# Altium schematic sheet POWER.SchDoc
size A4; DocumentNumber: 3; SheetNumber: 3; SheetTotal: 6
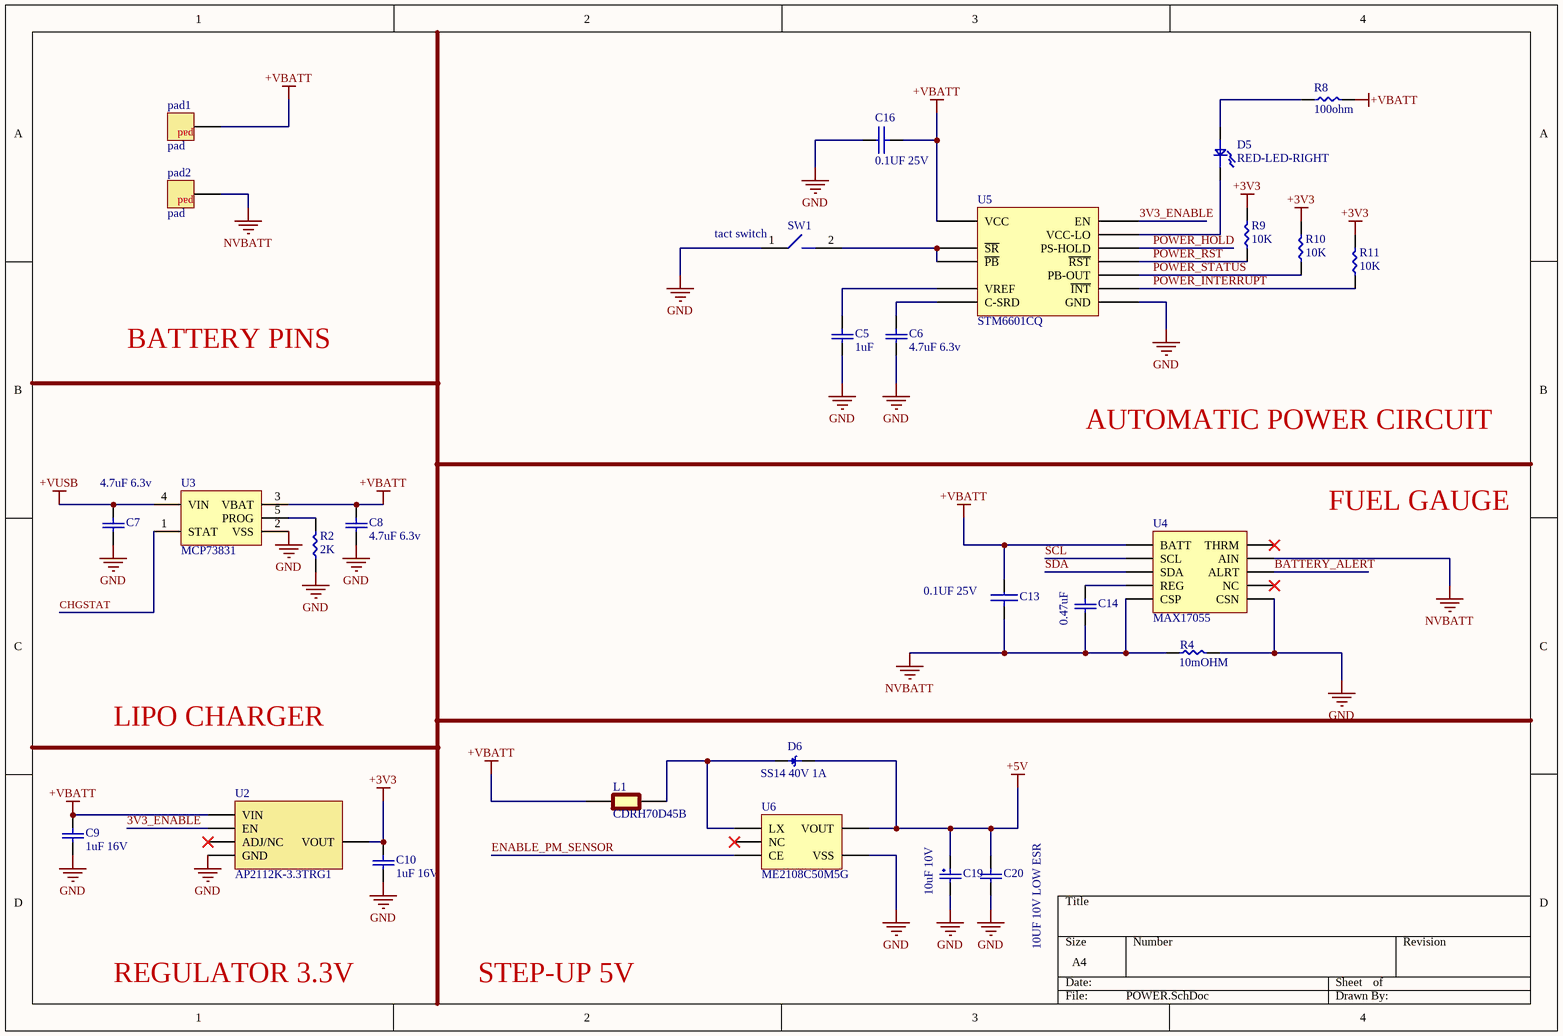
[diagram p0: POWER.SchDoc]

## Parts
C5  1uF  [C0603]
C6  4.7uF 6.3v  [C0603]
C7  4.7uF 6.3v  [C0603]
C8  4.7uF 6.3v  [C0603]
C9  1uF 16V  [C0805]
C10  1uF 16V  [C0805]
C13  0.1UF 25V  [C0603]
C14  0.47uF  [C0603]
C16  0.1UF 25V  [C0603]
C19  10uF 10V  [C3216]
C20  10UF 10V LOW ESR  [C1206]
D5  RED-LED-RIGHT  [LED0805RIGHT]
D6  SS14 40V 1A  [SMA]
L1  CDRH70D45B  [CDRH70D45B]
pad1  pad  [Pad 5x4mm]  (no BOM)
pad2  pad  [Pad 5x4mm]  (no BOM)
R2  2K  [R0603]
R4  10mOHM  [R2512]
R8  100ohm  [R0603]
R9  10K  [R0603]
R10  10K  [R0603]
R11  10K  [R0603]
SW1  tact switch  [Tacticle smd]
U2  AP2112K-3.3TRG1  [SOT-23-5]
U3  MCP73831  [SOT-23-5]
U4  MAX17055  [TDFN-EP]
U5  STM6601CQ  [SON50P300X200X80-12N]
U6  ME2108C50M5G  [SOT-23-5]

## Nets
+3V3: C10.2 R9.2 R10.2 R11.2 U2.5(VOUT)
+5V: C19.2 C20.2 D6.2 U6.2(VOUT)
+VBATT: C8.2 C9.2 C13.1 C16.2 L1.1 pad1.1 R8.2 U2.1(VIN) U3.3(VBAT) U4.10(BATT) U5.1(VCC)
+VUSB: C7.2 U3.4(VIN)
GND: C5.1 C6.1 C7.1 C8.1 C9.1 C10.1 C16.1 C19.1 C20.1 R2.1 R4.2 SW1.1 U2.2(GND) U3.2(VSS) U4.5(CSN) U5.12(GND) U6.4(VSS)
NVBATT: C13.2 C14.1 pad2.1 R4.1 U4.2(AIN) U4.6(CSP)
3V3_ENABLE: U2.3(EN) U5.9(EN)
BATTERY_ALERT: U4.8(ALRT)
CHGSTAT: U3.1(STAT)
ENABLE_PM_SENSOR: U6.1(CE)
POWER_HOLD: U5.4(PS-HOLD)
POWER_INTERRUPT: R11.1 U5.11(~{INT})
POWER_RST: R9.1 U5.10(~{RST})
POWER_STATUS: R10.1 U5.8(PB-OUT)
SCL: U4.3(SCL)
SDA: U4.4(SDA)
NetC5_2: C5.2 U5.3(VREF)
NetC6_2: C6.2 U5.5(C-SRD)
NetC14_2: C14.2 U4.7(REG)
NetD5_1: D5.1 R8.1
NetD5_2: D5.2 U5.7(VCC-LO)
NetD6_1: D6.1 L1.2 U6.5(LX)
NetR2_2: R2.2 U3.5(PROG)
NetSW1_2: SW1.2 U5.2(~{SR}) U5.6(~{PB})

Not connected (* = marked no-connect by the designer): U2 4(ADJ/NC)*; U4 1(NC)* 9(THRM)*; U6 3(NC)*

## Notes on the sheet
- BATTERY PINS
- AUTOMATIC POWER CIRCUIT
- FUEL GAUGE
- LIPO CHARGER
- REGULATOR 3.3V
- STEP-UP 5V

## Library data of the parts
C5 = UMK107BJ105KA-T: CAP CER 1UF 50V X5R 0603; Manufacturer: Taiyo Yuden; Catalog Drawings: xMK Series_0603_0.8; Capacitance: 1µF; Tolerance: ±10%; Online Catalog: M Series; Other Names: 587-2400-6; Supplier 1: Digi-Key; Manufacturer Part Number: UMK107BJ105KA-T; Stock 1: 2604996; Pricing 1: 1=0.18, 10=0.129, 100=0.0605, 500=0.0424, 1000=0.0351 (USD); Standard Package: 1; Category: Capacitors; Family: Ceramic Capacitors; Series: M; Packaging: Digi-Reel®; Voltage - Rated: 50V; Temperature Coefficient: X5R; Mounting Type: Surface Mount, MLCC; Operating Temperature: -55°C ~ 85°C; Applications: General Purpose; Ratings: -; Package / Case: 0603 (1608 Metric); Size / Dimension: 0.063" L x 0.031" W (1.60mm x 0.80mm); Height - Seated (Max): -; Thickness (Max): 0.035" (0.90mm); Lead Spacing: -; Features: -; Lead Style: -; ComponentLink1URL: http://www.farnell.com/datasheets/2091858.pdf?src-supplier=Farnell; ComponentLink1Description: http://www.farnell.com/datasheets/2091858.pdf?src-supplier=Farnell; ComponentLink2URL: https://www.yuden.co.jp/productdata/catalog/mlcc_all_e.pdf?src-supplier=Avnet; ComponentLink2Description: https://www.yuden.co.jp/productdata/catalog/mlcc_all_e.pdf?src-supplier=Avnet; ComponentLink3URL: https://www.yuden.co.jp/productdata/catalog/mlcc_all_e.pdf?src-supplier=Onlinecomponents.com; ComponentLink3Description: https://www.yuden.co.jp/productdata/catalog/mlcc_all_e.pdf?src-supplier=Onlinecomponents.com; ComponentLink4URL: http://ds.yuden.co.jp/TYCOMPAS/ut/detail.do?productNo=UMK107BJ105KA-T&amp;fileName=UMK107BJ105KA-T_SS&amp;mode=specSheetDownload&src-supplier=Digi-Key; ComponentLink4Description: http://ds.yuden.co.jp/TYCOMPAS/ut/detail.do?productNo=UMK107BJ105KA-T&amp;fileName=UMK107BJ105KA-T_SS&amp;mode=specSheetDownload&src-supplier=Digi-Key; ComponentLink5URL: http://www.farnell.com/datasheets/2091858.pdf?src-supplier=Element14; ComponentLink5Description: http://www.farnell.com/datasheets/2091858.pdf?src-supplier=Element14; ComponentLink6URL: http://www.yuden.co.jp/ut/product/pdf_html/pdf/mlcc_all_e.pdf?src-supplier=Element14; ComponentLink6Description: http://www.yuden.co.jp/ut/product/pdf_html/pdf/mlcc_all_e.pdf?src-supplier=Element14; ComponentLink7URL: https://www.yuden.co.jp/productdata/catalog/mlcc_all_e.pdf?src-supplier=Mouser; ComponentLink7Description: https://www.yuden.co.jp/productdata/catalog/mlcc_all_e.pdf?src-supplier=Mouser; Supplier Part Number 1: 587-2400-1-ND
C6-C8 = C0603C475K9PACTU: KEMET - C0603C475K9PACTU - KONDENSATOR, 4.7µF, 6.3V, 10%, X5R, 0603; Capacitor Terminals: SMD; SVHC: –; Capacitor Case Style: 0603; Supplier 1: Digi-Key; Manufacturer: KEMET; Manufacturer Part Number: C0603C475K9PACTU; Stock 1: 2903916; Pricing 1: 1=0.17, 10=0.12, 100=0.0565, 500=0.0396, 1000=0.0328 (USD); Lead Spacing: –; MSL: –; Capacitance: 4.7µF; Capacitance Tolerance: ± 10%; Dielectric Characteristic: X5R; Voltage Rating: 6.3V; Operating Temperature Range: -55°C to +85°C; ComponentLink1URL: https://api.kemet.com/component-edge/download/datasheet/C0603C475K9PACTU.pdf?src-supplier=Digi-Key; ComponentLink1Description: https://api.kemet.com/component-edge/download/datasheet/C0603C475K9PACTU.pdf?src-supplier=Digi-Key; ComponentLink2URL: http://www.farnell.com/datasheets/2739654.pdf?src-supplier=Element14; ComponentLink2Description: http://www.farnell.com/datasheets/2739654.pdf?src-supplier=Element14; ComponentLink3URL: http://www.farnell.com/datasheets/40889.pdf?src-supplier=Element14; ComponentLink3Description: http://www.farnell.com/datasheets/40889.pdf?src-supplier=Element14; Supplier Part Number 1: 399-3482-1-ND
C9 C10 = GRM21BR71C105KA01L: CAP CER 1UF 16V X7R 0805; Manufacturer: Murata Electronics North America; Tolerance: ±10%; Supplier 1: Digi-Key; Manufacturer Part Number: GRM21BR71C105KA01L; RoHS: RoHS Compliant; Category: Capacitors; Stock 1: 397728; Pricing 1: 1=0.11, 10=0.083, 100=0.0372, 500=0.02656, 1000=0.02087 (USD); Packaging: Cut Tape (CT); Part Status: Active; Voltage - Rated: 16V; Temperature Coefficient: X7R; Operating Temperature: -55°C ~ 125°C; Features: -; Ratings: -; Applications: General Purpose; Mounting Type: Surface Mount, MLCC; Package / Case: 0805 (2012 Metric); Size / Dimension: 0.079" L x 0.049" W (2.00mm x 1.25mm); Height - Seated (Max): -; Thickness (Max): 0.053" (1.35mm); Lead Spacing: -; Lead Style: -; ComponentLink1URL: http://search.murata.co.jp/Ceramy/image/img/A01X/G101/ENG/GRM21BR71C105KA01-01.pdf; ComponentLink1Description: http://search.murata.co.jp/Ceramy/image/img/A01X/G101/ENG/GRM21BR71C105KA01-01.pdf; Supplier Part Number 1: 490-1691-1-ND
C13 C16 = 06033D104KAT2A: CAP CER 0.1UF 25V X5R 0603; Manufacturer: Kyocera AVX; Capacitance: 100 nF; Tolerance (%): ±10 %; Supplier 1: Digi-Key; Manufacturer Part Number: 06033D104KAT2A; Stock 1: 0; Pricing 1: 1=0.32, 10=0.221, 100=0.1328, 500=0.0996, 1000=0.0841 (USD); Case Size/Dimension: 0603; Dielectric: X5R; Rated Voltage: 25 V; ComponentLink1URL: https://datasheet.ciiva.com/19475/1031061-19475906.pdf; ComponentLink1Description: https://datasheet.ciiva.com/19475/1031061-19475906.pdf; ComponentLink2URL: https://datasheet.ciiva.com/28613/759405-28613274.pdf; ComponentLink2Description: https://datasheet.ciiva.com/28613/759405-28613274.pdf; ComponentLink3URL: https://datasheet.ciiva.com/16397/cx5r-16397162.pdf; ComponentLink3Description: https://datasheet.ciiva.com/16397/cx5r-16397162.pdf; ComponentLink4URL: https://datasheet.ciiva.com/28613/1666675-28613037.pdf; ComponentLink4Description: https://datasheet.ciiva.com/28613/1666675-28613037.pdf; ComponentLink5URL: https://datasheet.ciiva.com/28613/1666675-28613275.pdf; ComponentLink5Description: https://datasheet.ciiva.com/28613/1666675-28613275.pdf; ComponentLink6URL: https://datasheet.ciiva.com/152/cx5r-152227.pdf; ComponentLink6Description: https://datasheet.ciiva.com/152/cx5r-152227.pdf; ComponentLink7URL: https://datasheet.ciiva.com/152/cx5r-152226.pdf; ComponentLink7Description: https://datasheet.ciiva.com/152/cx5r-152226.pdf; ComponentLink8URL: https://datasheet.ciiva.com/2987/cx5r-2987761.pdf; ComponentLink8Description: https://datasheet.ciiva.com/2987/cx5r-2987761.pdf; ComponentLink9URL: https://datasheet.ciiva.com/152/cx5r-152225.pdf; ComponentLink9Description: https://datasheet.ciiva.com/152/cx5r-152225.pdf; ComponentLink10URL: https://datasheet.ciiva.com/2987/cx5r-2987762.pdf; ComponentLink10Description: https://datasheet.ciiva.com/2987/cx5r-2987762.pdf; Supplier Part Number 1: 478-1244-6-ND
C14 = C0603C474K4PACTU: CAP CER 0.47UF 16V 10% X5R 0603; Manufacturer: KEMET; Part # Aliases: C0603C474K4PAC7867; Capacitance - nF: 470 nF; Capacitance - pF: 470000 pF; Case Height: 0.8 mm; Dissipation Factor DF: 5; Case Length: 1.6 mm; Class: Class 2; Temperature Coefficient / Code: +/- 15 %; Type: SMD MLCC X5R 4 - 50 VDC Commerical Grade; Supplier 1: Digi-Key; Manufacturer Part Number: C0603C474K4PACTU; Stock 1: 22191; Pricing 1: 1=0.17, 10=0.118, 100=0.0556, 500=0.039, 1000=0.0323 (USD); Brand: Kemet; Capacitance: 0.47 uF; Case Code - in: 0603; Case Code - mm: 1608; Dimensions: 0.8 mm W x 1.6 mm L x 0.8 mm H; Dielectric: X5R; Case Width: 0.8 mm; Factory Pack Quantity: 4000; Product Category: Multilayer Ceramic Capacitors MLCC - SMD/SMT; RoHS: Details; Tolerance: 10 %; Minimum Operating Temperature: - 55 C; Maximum Operating Temperature: + 85 C; Product: General Type MLCCs; Lead Spacing: 0.7 mm; Operating Temperature Range: - 55 C to + 85 C; Package / Case: 0603 (1608 metric); Packaging: Reel; Series: C0603C; Termination Style: SMD/SMT; Voltage Rating: 16 V; Voltage Rating DC: 16 V; Supplier Part Number 1: 399-7934-1-ND
C19 = T491A106K010AT: CAP TANT 10UF 10V 10% 1206; Manufacturer: KEMET; Manufacturer Size Code: A; Type: Molded; ESR (Equivalent Series Resistance): 3.8 Ohm; Lifetime @ Temp.: 2000 Hrs @ 85°C; Supplier 1: Digi-Key; Manufacturer Part Number: T491A106K010AT; RoHS: RoHS Compliant; Category: Capacitors; Stock 1: 741056; Pricing 1: 1=0.41, 10=0.287, 100=0.1721, 500=0.12912, 1000=0.10903 (USD); Packaging: Cut Tape (CT); Part Status: Active; Tolerance: ±10%; Operating Temperature: -55°C ~ 125°C; Mounting Type: Surface Mount; Package / Case: 1206 (3216 Metric); Size / Dimension: 0.126" L x 0.063" W (3.20mm x 1.60mm); Height - Seated (Max): 0.071" (1.80mm); Lead Spacing: -; Features: General Purpose; Failure Rate: -; ComponentLink1URL: http://www.kemet.com/Lists/ProductCatalog/Attachments/254/KEM_T2005_T491.pdf; ComponentLink1Description: http://www.kemet.com/Lists/ProductCatalog/Attachments/254/KEM_T2005_T491.pdf; Supplier Part Number 1: 399-3684-1-ND
C20 = LMK316BJ106MLHT: CAP CER 10UF 10V X5R 1206; Manufacturer: Taiyo Yuden; Tolerance: ±20%; Supplier 1: Digi-Key; Manufacturer Part Number: LMK316BJ106MLHT; RoHS: RoHS Compliant; Category: Capacitors; Stock 1: 0; Pricing 1: 2000=0.07458 (USD); Packaging: Tape & Reel (TR); Part Status: Active; Voltage - Rated: 10V; Temperature Coefficient: X5R; Operating Temperature: -55°C ~ 85°C; Features: Ultra Low ESR; Ratings: AEC-Q200; Applications: Automotive, SMPS Filtering; Failure Rate: -; Mounting Type: Surface Mount, MLCC; Package / Case: 1206 (3216 Metric); Size / Dimension: 0.126" L x 0.063" W (3.20mm x 1.60mm); Height - Seated (Max): -; Thickness (Max): 0.071" (1.80mm); Lead Spacing: -; Lead Style: -; ComponentLink1URL: http://www.yuden.co.jp/productdata/catalog/en/mlcc_all_hq_e.pdf; ComponentLink1Description: http://www.yuden.co.jp/productdata/catalog/en/mlcc_all_hq_e.pdf; Supplier Part Number 1: LMK316BJ106MLHT-ND
D5 = LTST-S270KRKT: LED RED CLEAR 0603 R/A SMD; Manufacturer: Lite-On Inc.; Lens Color: Colorless; Millicandela Rating: 54mcd; Lens Style/Size: Rectangle with Flat Top, 1.20mm x 0.60mm; Voltage - Forward (Vf) (Typ): 2V; Current - Test: 20mA; Viewing Angle: 130°; Wavelength - Dominant: 631nm; Wavelength - Peak: 639nm; Supplier 1: Digi-Key; Manufacturer Part Number: LTST-S270KRKT; RoHS: RoHS Compliant; Category: Optoelectronics; Stock 1: 443917; Pricing 1: 1=0.27, 10=0.196, 25=0.1448, 100=0.1034, 250=0.07032, 500=0.06204, 1000=0.0486 (USD); Packaging: Digi-Reel®; Part Status: Active; Color: Red; Lens Transparency: Clear; Mounting Type: Surface Mount, Right Angle; Features: -; Package / Case: 0603 (1608 Metric); Supplier Device Package: Chip LED; Size / Dimension: 1.60mm L x 1.15mm W; Height (Max): 0.60mm; ComponentLink1URL: http://optoelectronics.liteon.com/upload/download/DS22-2000-210/LTST-S270KRKT.pdf; ComponentLink1Description: http://optoelectronics.liteon.com/upload/download/DS22-2000-210/LTST-S270KRKT.pdf; Supplier Part Number 1: 160-1479-6-ND
D6 = SS14: DIODE SCHOTTKY 40V 1A SMA; Manufacturer: Microsemi; Rectifier Type: Schottky Diode; Configuration: Single; Rev Curr: 500uA; Peak Non-Repetitive Surge Current: 30A; Forward Voltage: 600mV; Supplier 1: Digi-Key; Manufacturer Part Number: SS14; Stock 1: 177418; Pricing 1: 1=0.38, 10=0.31, 25=0.2592, 100=0.1267, 250=0.1247, 500=0.1057, 1000=0.0734, 2500=0.0683 (USD); Peak Rep Rev Volt: 40V; Avg. Forward Curr (Max): 1A; Operating Temp Range: -55C to 125C; Package Type: DO-214AC; Operating Temperature Classification: Military; Mounting: Surface Mount; Pin Count: 2; Supplier Part Number 1: SS14DKR-ND
L1 = CDRH70D45BT150NP-470MC: Ind Power 47uF 20% Ferrite Drum Core; Manufacturer: Sumida; Supplier 1: Digi-Key; Manufacturer Part Number: CDRH70D45BT150NP-470MC; Stock 1: 0; Pricing 1: 1=2.73, 10=2.519, 100=1.763, 500=1.4272, 1000=1.3012 (USD); Supplier Part Number 1: 308-CDRH70D45BT150NP-470MCCT-ND
pad1 pad2 = Pad5x4mm
R2 = ERJ-3EKF2001V: RES SMD 2K OHM 1% 1/10W 0603; Manufacturer: Panasonic; Rated Power: 0.1 W; Resistance: 2 kO; Temp Coefficient: ±100 ppm/°C; Supplier 1: Digi-Key; Manufacturer Part Number: ERJ-3EKF2001V; Stock 1: 848013; Pricing 1: 1=0.1, 10=0.068, 100=0.0278, 1000=0.0125, 2500=0.0109 (USD); Size Code: 0603; Tolerance (%): ±1 %; ComponentLink1URL: http://industrial.panasonic.com/www-data/pdf/AOA0000/AOA0000CE2.pdf?src-supplier=Future+Electronics; ComponentLink1Description: http://industrial.panasonic.com/www-data/pdf/AOA0000/AOA0000CE2.pdf?src-supplier=Future+Electronics; ComponentLink2URL: http://industrial.panasonic.com/cdbs/www-data/pdf/RDA0000/AOA0000C304.pdf?src-supplier=Farnell; ComponentLink2Description: http://industrial.panasonic.com/cdbs/www-data/pdf/RDA0000/AOA0000C304.pdf?src-supplier=Farnell; ComponentLink3URL: http://www.farnell.com/datasheets/1678782.pdf?src-supplier=Element14; ComponentLink3Description: http://www.farnell.com/datasheets/1678782.pdf?src-supplier=Element14; ComponentLink4URL: http://www.farnell.com/datasheets/1911175.pdf?src-supplier=Element14; ComponentLink4Description: http://www.farnell.com/datasheets/1911175.pdf?src-supplier=Element14; ComponentLink5URL: https://industrial.panasonic.com/cdbs/www-data/pdf/RDA0000/DMA0000COL11.pdf?src-supplier=Allied+Electronics; ComponentLink5Description: https://industrial.panasonic.com/cdbs/www-data/pdf/RDA0000/DMA0000COL11.pdf?src-supplier=Allied+Electronics; ComponentLink6URL: http://industrial.panasonic.com/www-data/pdf/AOA0000/AOA0000CE2.pdf?src-supplier=Avnet+Europe; ComponentLink6Description: http://industrial.panasonic.com/www-data/pdf/AOA0000/AOA0000CE2.pdf?src-supplier=Avnet+Europe; ComponentLink7URL: http://www.farnell.com/datasheets/1911175.pdf?src-supplier=Farnell; ComponentLink7Description: http://www.farnell.com/datasheets/1911175.pdf?src-supplier=Farnell; ComponentLink8URL: https://industrial.panasonic.com/cdbs/www-data/pdf/RDA0000/DMA0000COL11.pdf?src-supplier=Mouser; ComponentLink8Description: https://industrial.panasonic.com/cdbs/www-data/pdf/RDA0000/DMA0000COL11.pdf?src-supplier=Mouser; Supplier Part Number 1: P2.00KHDKR-ND
R4 = CSR25120R01F: RES 0.01 OHM 1% 1W 2512; Manufacturer: Riedon; Resistance (Ohms): 0.01; Temperature Coefficient: ±75ppm/°C; Supplier 1: Digi-Key; Manufacturer Part Number: CSR25120R01F; Stock 1: 46648; Pricing 1: 1=0.64, 10=0.531, 25=0.4556, 50=0.4098, 100=0.3567, 250=0.3188, 500=0.2581, 1000=0.2087 (USD); Category: Resistors; Family: Chip Resistor - Surface Mount; Series: CSR; Packaging: Tape & Reel (TR); Tolerance: ±1%; Power (Watts): 1W; Composition: Metal Element; Features: Current Sense; Operating Temperature: -55°C ~ 170°C; Package / Case: 2512 (6432 Metric); Supplier Device Package: 2512; Size / Dimension: 0.250" L x 0.125" W (6.35mm x 3.18mm); Height: 0.033" (0.84mm); Number of Terminations: 2; ComponentLink1URL: https://riedon.com/media/pdf-tech/riedon_brochure_download.pdf?src-supplier=Digi-Key; ComponentLink1Description: https://riedon.com/media/pdf-tech/riedon_brochure_download.pdf?src-supplier=Digi-Key; ComponentLink2URL: http://riedon.com/media/pdf/CSR.pdf?src-supplier=Digi-Key; ComponentLink2Description: http://riedon.com/media/pdf/CSR.pdf?src-supplier=Digi-Key; Supplier Part Number 1: 696-1655-1-ND
R8 = CR0603-FX-1000ELF: Res Thick Film 0603 100 Ohm 1% 1/10W Â±100ppm/Â°C Molded SMD SMD Paper Tape on Plastic Reel; Manufacturer: Bourns; EDA / CAD Models: Download from Accelerated Designs; Resistance (Ohms): 100; Power (Watts): 0.1W, 1/10W; Temperature Coefficient: ±100ppm/°C; Online Catalog: CR Series; Other Names: CR0603-FX-1000ELFDKR; Supplier 1: Digi-Key; Manufacturer Part Number: CR0603-FX-1000ELF; Stock 1: 233644; Pricing 1: 1=0.1, 10=0.021, 100=0.0086, 1000=0.0039, 2500=0.0033 (USD); RoHS Information: CR0603-LF Material Declaration; Standard Package: 1; Category: Resistors; Family: Chip Resistor - Surface Mount; Series: CR0603; Packaging: Digi-Reel®; Tolerance: ±1%; Composition: Thick Film; Features: Moisture Resistant; Operating Temperature: -55°C ~ 155°C; Package / Case: 0603 (1608 Metric); Supplier Device Package: 0603; Size / Dimension: 0.063" L x 0.031" W (1.60mm x 0.80mm); Height: 0.022" (0.55mm); Number of Terminations: 2; ComponentLink1URL: http://www.farnell.com/datasheets/2178762.pdf?src-supplier=Newark; ComponentLink1Description: http://www.farnell.com/datasheets/2178762.pdf?src-supplier=Newark; ComponentLink2URL: https://www.bourns.com/docs/Product-Datasheets/CHPREZTR.pdf?src-supplier=Digi-Key; ComponentLink2Description: https://www.bourns.com/docs/Product-Datasheets/CHPREZTR.pdf?src-supplier=Digi-Key; ComponentLink3URL: http://www.farnell.com/datasheets/691949.pdf?src-supplier=Element14; ComponentLink3Description: http://www.farnell.com/datasheets/691949.pdf?src-supplier=Element14; ComponentLink4URL: http://www.bourns.com/pdfs/chpreztr.pdf?src-supplier=Avnet+Europe; ComponentLink4Description: http://www.bourns.com/pdfs/chpreztr.pdf?src-supplier=Avnet+Europe; ComponentLink5URL: http://uk.rs-online.com/webdocs/0fcd/0900766b80fcdb72.pdf?src-supplier=RSComponents; ComponentLink5Description: http://uk.rs-online.com/webdocs/0fcd/0900766b80fcdb72.pdf?src-supplier=RSComponents; ComponentLink6URL: http://www.produktinfo.conrad.com/datenblaetter/1000000-1099999/001055482-da-01-en-SMD_WID_CR0603_FX_1000ELF_100_OHM_1_10W.pdf?src-supplier=Conrad; ComponentLink6Description: http://www.produktinfo.conrad.com/datenblaetter/1000000-1099999/001055482-da-01-en-SMD_WID_CR0603_FX_1000ELF_100_OHM_1_10W.pdf?src-supplier=Conrad; Supplier Part Number 1: CR0603-FX-1000ELFCT-ND
R9-R11 = RC0603FR-0710KL: RES SMD 10K OHM 1% 1/10W 0603; Manufacturer: Yageo; Power (Watts): 0.1W, 1/10W; Temperature Coefficient: ±100ppm/°C; Supplier 1: Digi-Key; Manufacturer Part Number: RC0603FR-0710KL; RoHS: RoHS Compliant; Category: Resistors; Stock 1: 5916612; Pricing 1: 1=0.1, 10=0.015, 100=0.006, 1000=0.00268, 2500=0.00233 (USD); Packaging: Digi-Reel®; Part Status: Active; Tolerance: ±1%; Composition: Thick Film; Features: Moisture Resistant; Operating Temperature: -55°C ~ 155°C; Package / Case: 0603 (1608 Metric); Supplier Device Package: 0603; Size / Dimension: 0.063" L x 0.032" W (1.60mm x 0.80mm); Height - Seated (Max): 0.022" (0.55mm); Failure Rate: -; ComponentLink1URL: http://www.yageo.com/documents/recent/PYu-RC_Group_51_RoHS_L_8.pdf; ComponentLink1Description: http://www.yageo.com/documents/recent/PYu-RC_Group_51_RoHS_L_8.pdf; Supplier Part Number 1: 311-10.0KHRDKR-ND
SW1 = EVQ-P7A01P: SWITCH TACTILE SPST-NO 0.05A 12V; Manufacturer: Panasonic Electronic Components; Switch Function: Off-Mom; Contact Rating @ Voltage: 0.05A @ 12VDC; Actuator Type: Rectangular Button; Actuator Orientation: Side Actuated; Outline: 3.50mm x 2.90mm; Illumination: Non-Illuminated; Operating Force: 220gf; Switch Travel: 0.20mm; Mechanical Life: 100,000 Cycles; Supplier 1: Digi-Key; Manufacturer Part Number: EVQ-P7A01P; RoHS: RoHS Compliant; Category: Switches; Stock 1: 17874; Pricing 1: 1=0.3, 10=0.285, 25=0.2748, 50=0.2646, 100=0.2544, 250=0.23404, 500=0.2035, 1000=0.17298 (USD); Packaging: Cut Tape (CT); Part Status: Active; Circuit: SPST-NO; Mounting Type: Surface Mount, Right Angle; Actuator Height off PCB, Vertical: -; Actuator Length, Right Angle: -; Termination Style: Gull Wing; Illumination Type, Color: -; Illumination Voltage (Nominal): -; Ingress Protection: -; Features: -; Actuator Material: -; Operating Temperature: -20°C ~ 70°C; ComponentLink1URL: https://www3.panasonic.biz/ac/e_download/control/switch/light-touch/catalog/sw_lt_eng_3529s_side.pdf; ComponentLink1Description: https://www3.panasonic.biz/ac/e_download/control/switch/light-touch/catalog/sw_lt_eng_3529s_side.pdf; Supplier Part Number 1: P16763CT-ND
U2 = AP2112K-3.3TRG1: IC REG LINEAR 3.3V 600MA SOT25; Manufacturer: Diodes Incorporated; Output Configuration: Positive; Output Type: Fixed; Voltage - Input (Max): 6V; Voltage Dropout (Max): 0.4V @ 600mA; PSRR: 65sB (100Hz ~ 1KHz); Control Features: Enable; Protection Features: Over Current, Over Temperature; Supplier 1: Digi-Key; Manufacturer Part Number: AP2112K-3.3TRG1; RoHS: RoHS Compliant; Category: Integrated Circuits (ICs); Stock 1: 36000; Pricing 1: 3000=0.10368, 6000=0.09792, 15000=0.08928, 30000=0.08352, 75000=0.07488 (USD); Packaging: Tape & Reel (TR); Part Status: Active; Voltage - Output (Min/Fixed): 3.3V; Voltage - Output (Max): -; Current - Output: 600mA; Operating Temperature: -40°C ~ 85°C; Mounting Type: Surface Mount; Package / Case: SC-74A, SOT-753; Supplier Device Package: SOT-25; ComponentLink1URL: https://www.diodes.com/assets/Datasheets/AP2112.pdf; ComponentLink1Description: https://www.diodes.com/assets/Datasheets/AP2112.pdf; Supplier Part Number 1: AP2112K-3.3TRG1DITR-ND
U3 = MCP73831T-2ACI/OT: IC CONTROLLR LI-ION 4.2V SOT23-5; Manufacturer: Microchip Technology; Battery Chemistry: Lithium-Ion/Polymer; Number of Cells: 1; Current - Charging: Constant - Programmable; Programmable Features: Current; Fault Protection: Over Voltage; Charge Current - Max: 500mA; Voltage - Supply (Max): 6V; Supplier 1: Digi-Key; Manufacturer Part Number: MCP73831T-2ACI/OT; RoHS: RoHS Compliant; Category: Integrated Circuits (ICs); Stock 1: 86533; Pricing 1: 1=0.59, 25=0.4936, 100=0.441 (USD); Packaging: Cut Tape (CT); Part Status: Active; Battery Pack Voltage: 4.2V; Interface: -; Operating Temperature: -40°C ~ 85°C (TA); Package / Case: SC-74A, SOT-753; Supplier Device Package: SOT-23-5; ComponentLink1URL: http://www.microchip.com/mymicrochip/filehandler.aspx?ddocname=en025112; ComponentLink1Description: http://www.microchip.com/mymicrochip/filehandler.aspx?ddocname=en025112; Supplier Part Number 1: MCP73831T-2ACI/OTCT-ND
U4 = MAX17055ETB+T: IC FUEL GAUGE MODELGAUGE 10TDFN; Manufacturer: Maxim; Categories: Integrated Circuits (ICs); Function: Battery Monitor; Battery Chemistry: Multi-Chemistry; Number of Cells: 1; Interface: I²C; Supplier 1: Digi-Key; Manufacturer Part Number: MAX17055ETB+T; Stock 1: 7808; Pricing 1: 1=2.16, 10=1.942, 25=1.836, 100=1.5096, 250=1.3546, 500=1.326 (USD); Series: ModelGauge™; Packaging: Cut Tape (CT); Part Status: Active; Fault Protection: -; Operating Temperature: -40°C ~ 85°C (TA); Package / Case: 10-WFDFN Exposed Pad; Supplier Device Package: 10-TDFN (2.5x2.0); Base Part Number: MAX17055; ComponentLink1URL: https://pdfserv.maximintegrated.com/en/an/AN6365.pdf?src-supplier=Digi-Key; ComponentLink1Description: https://pdfserv.maximintegrated.com/en/an/AN6365.pdf?src-supplier=Digi-Key; ComponentLink2URL: http://www.farnell.com/datasheets/2608092.pdf?src-supplier=Farnell; ComponentLink2Description: http://www.farnell.com/datasheets/2608092.pdf?src-supplier=Farnell; Supplier Part Number 1: MAX17055ETB+TCT-ND
U5 = STM6601CQ2BDM6F: On/Off Controller 12-Pin TDFN T/R; Manufacturer: STMicroelectronics; Other Related Documents: STM6601 View All Specifications; Product Training Modules: STM660x Smart On/Off Controller; Number of Voltages Monitored: 1; Output: Open Drain or Open Collector; Reset: Active Low; Voltage - Threshold: 3.3V; Dynamic Catalog: Smart ON/OFF Controller, Reset; Other Names: 497-10133-6; Supplier 1: Digi-Key; Manufacturer Part Number: STM6601CQ2BDM6F; Stock 1: 114; Pricing 1: 1=1.51, 10=1.351, 25=1.2824, 100=0.9847, 250=0.8702, 500=0.8244, 1000=0.6412 (USD); Standard Package: 1; Category: Integrated Circuits (ICs); Family: PMIC - Supervisors; Series: Smart Reset™; Type: Smart ON/OFF Controller; Reset Timeout: -; Operating Temperature: -40°C ~ 85°C; Mounting Type: Surface Mount; Package / Case: 12-TDFN; Supplier Device Package: 12-TDFN (2x3); Packaging: Digi-Reel®; ComponentLink1URL: http://www.st.com/web/en/resource/technical/document/datasheet/CD00226957.pdf?src-supplier=Future+Electronics; ComponentLink1Description: http://www.st.com/web/en/resource/technical/document/datasheet/CD00226957.pdf?src-supplier=Future+Electronics; ComponentLink2URL: http://www.st.com/content/ccc/resource/sales_and_marketing/promotional_material/flyer/aa/21/1f/20/e0/b1/46/88/FLSTM66XX0215.pdf/files/FLSTM66XX0215.pdf/jcr:content/translations/en.FLSTM66XX0215.pdf?src-supplier=Digi-Key; ComponentLink2Description: http://www.st.com/content/ccc/resource/sales_and_marketing/promotional_material/flyer/aa/21/1f/20/e0/b1/46/88/FLSTM66XX0215.pdf/files/FLSTM66XX0215.pdf/jcr:content/translations/en.FLSTM66XX0215.pdf?src-supplier=Digi-Key; ComponentLink3URL: http://www.st.com/content/ccc/resource/technical/document/datasheet/1f/9e/3b/43/ec/04/44/71/CD00226957.pdf/files/CD00226957.pdf/jcr:content/translations/en.CD00226957.pdf?src-supplier=Digi-Key; ComponentLink3Description: http://www.st.com/content/ccc/resource/technical/document/datasheet/1f/9e/3b/43/ec/04/44/71/CD00226957.pdf/files/CD00226957.pdf/jcr:content/translations/en.CD00226957.pdf?src-supplier=Digi-Key; ComponentLink4URL: http://www.st.com/web/en/resource/technical/document/datasheet/CD00226957.pdf?src-supplier=Avnet+Europe; ComponentLink4Description: http://www.st.com/web/en/resource/technical/document/datasheet/CD00226957.pdf?src-supplier=Avnet+Europe; ComponentLink5URL: http://www.produktinfo.conrad.com/datenblaetter/1100000-1199999/001184326-da-01-en-IC_SUPERVISO_STM6601CQ2BDM6F_TDFN_12_STM.pdf?src-supplier=Conrad; ComponentLink5Description: http://www.produktinfo.conrad.com/datenblaetter/1100000-1199999/001184326-da-01-en-IC_SUPERVISO_STM6601CQ2BDM6F_TDFN_12_STM.pdf?src-supplier=Conrad; Supplier Part Number 1: 497-10133-1-ND